# EAGLE schematic 24x16_RGB_ATXMega_Wifi_BBuck (EAGLE 6.5.0)

## Sheet 1 of 8
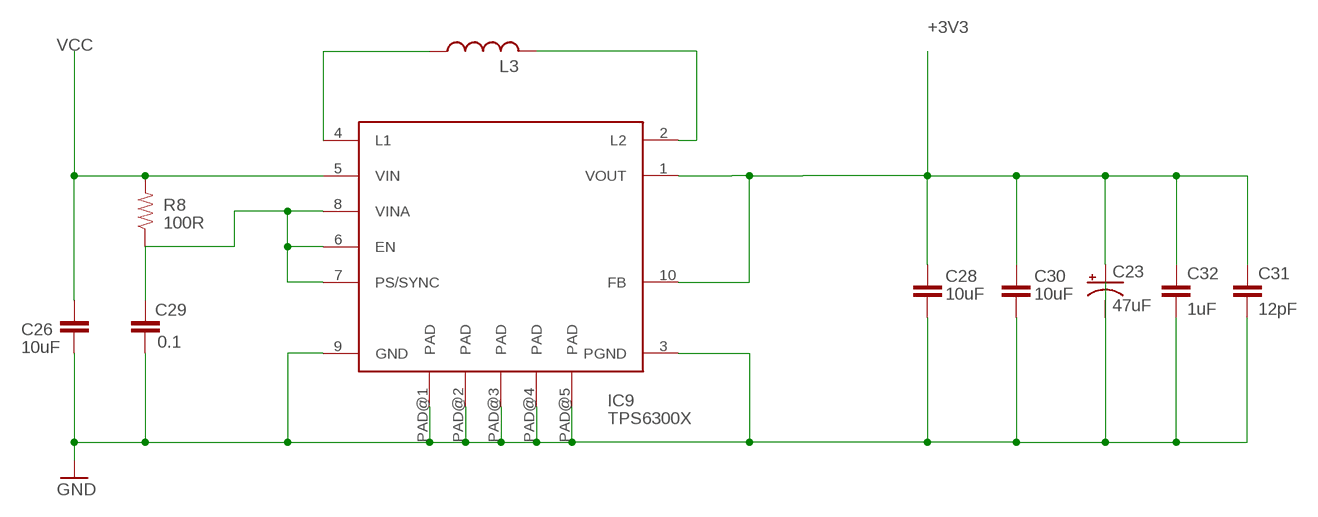
[diagram p0: schematic, sheet 1]

### Parts
C23  47uF  CAP_POL3528  [EIA3528]
C26  10uF  CAP0805  [0805]
C28  10uF  CAP0805  [0805]
C29  0.1  CAP0805  [0805]
C30  10uF  CAP0805  [0805]
C31  12pF  CAP0805  [0805]
C32  1uF  CAP0805  [0805]
IC9  TPS6300X  [QFN_10_PAD]
L3  L-USL1812  [L1812]
R8  100R  RESISTOR0805  [0805]

### Nets
+3V3: C23.A(+) C28.1 C30.1 C31.1 C32.1 IC9.1(VOUT) IC9.10(FB) ; also sheet 2,7,8
GND: C23.C(-) C26.2 C28.2 C29.1 C30.2 C31.2 C32.2 IC9.3(PGND) IC9.9(GND) IC9.PAD@1(PAD) IC9.PAD@2(PAD) IC9.PAD@3(PAD) IC9.PAD@4(PAD) IC9.PAD@5(PAD) ; also sheet 2,3,5,6,7,8
N$24: IC9.2(L2) L3.2
N$30: IC9.4(L1) L3.1
N$32: C29.2 IC9.6(EN) IC9.7(PS/SYNC) IC9.8(VINA) R8.1
VCC: C26.1 IC9.5(VIN) R8.2 ; also sheet 2,3,4,5,6

## Sheet 2 of 8
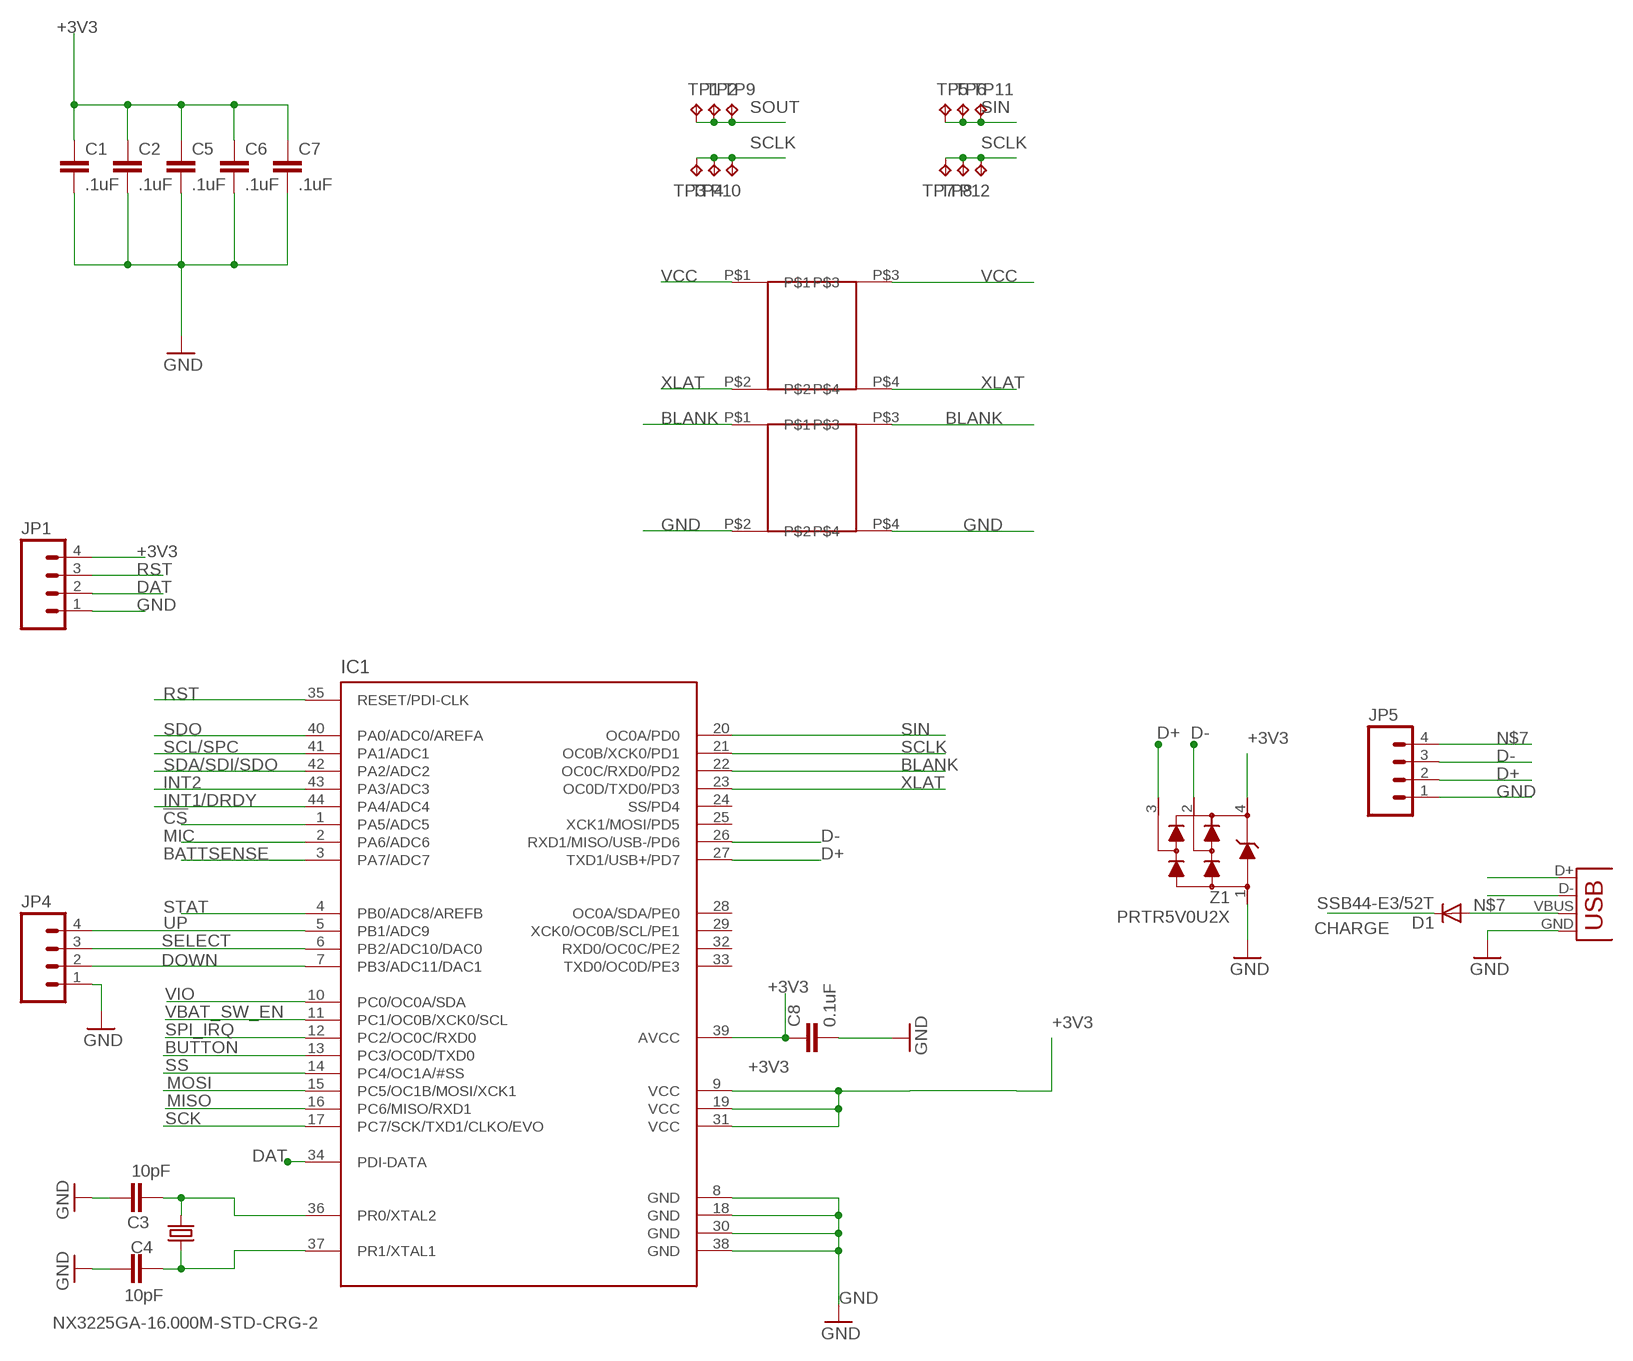
[diagram p1: schematic, sheet 2]

### Parts
C1  .1uF  CAP0805  [0805]
C2  .1uF  CAP0805  [0805]
C3  10pF  CAP0805  [0805]
C4  10pF  CAP0805  [0805]
C5  .1uF  CAP0805  [0805]
C6  .1uF  CAP0805  [0805]
C7  .1uF  CAP0805  [0805]
C8  0.1uF  CAP0805  [0805]
D1  SSB44-E3/52T  DIODE-DO214AA  [DO214AA]
IC1  NONOLITH_ATXMEGAXXA4U-AU  [NONOLITH_TQFP-44]
JP1  M04PTH  [1X04]
JP3  USBSMD  [USB-MINIB]
JP4  M04PTH  [1X04]
JP5  M04PTH  [1X04]
SLOT1  SLOT  [SLOT]
SLOT2  SLOT  [SLOT]
TP1  TPTP20SQ  [TP20SQ]
TP2  TPTP20SQ  [TP20SQ]
TP3  TPTP20SQ  [TP20SQ]
TP4  TPTP20SQ  [TP20SQ]
TP5  TPTP20SQ  [TP20SQ]
TP6  TPTP20SQ  [TP20SQ]
TP7  TPTP20SQ  [TP20SQ]
TP8  TPTP20SQ  [TP20SQ]
TP9  TPTP20SQ  [TP20SQ]
TP10  TPTP20SQ  [TP20SQ]
TP11  TPTP20SQ  [TP20SQ]
TP12  TPTP20SQ  [TP20SQ]
X1  NX3225GA-16.000M-STD-CRG-2  NX3225GA  [NX3225GA]
Z1  PRTR5V0U2X  [SOT143B]

### Nets
!CS: IC1.1(PA5/ADC5) ; also sheet 7
+3V3: C1.1 C2.1 C5.1 C6.1 C7.1 C8.1 IC1.9(VCC) IC1.19(VCC) IC1.31(VCC) IC1.39(AVCC) JP1.4 Z1.4 ; also sheet 1,7,8
BATTSENSE: IC1.3(PA7/ADC7) ; also sheet 5
BLANK: IC1.22(OC0C/RXD0/PD2) SLOT2.P$1 SLOT2.P$3 ; also sheet 3
BUTTON: IC1.13(PC3/OC0D/TXD0) ; also sheet 7
CHARGE: D1.C ; also sheet 5
D+: IC1.27(TXD1/USB+/PD7) JP3.D+ JP5.2 Z1.3
D-: IC1.26(RXD1/MISO/USB-/PD6) JP3.D- JP5.3 Z1.2
DAT: IC1.34(PDI-DATA) JP1.2
DOWN: IC1.7(PB3/ADC11/DAC1) JP4.2
GND: C1.2 C2.2 C3.1 C4.1 C5.2 C6.2 C7.2 C8.2 IC1.8(GND) IC1.18(GND) IC1.30(GND) IC1.38(GND) JP1.1 JP3.GND JP4.1 JP5.1 SLOT2.P$2 SLOT2.P$4 Z1.1 ; also sheet 1,3,5,6,7,8
INT1/DRDY: IC1.44(PA4/ADC4) ; also sheet 7
INT2: IC1.43(PA3/ADC3) ; also sheet 7
MIC: IC1.2(PA6/ADC6) ; also sheet 8
MISO: IC1.16(PC6/MISO/RXD1) ; also sheet 6
MOSI: IC1.15(PC5/OC1B/MOSI/XCK1) ; also sheet 6
N$7: D1.A JP3.VBUS JP5.4
N$36: C3.2 IC1.36(PR0/XTAL2) X1.3
N$37: C4.2 IC1.37(PR1/XTAL1) X1.1
RST: IC1.35(RESET/PDI-CLK) JP1.3 ; also sheet 7
SCK: IC1.17(PC7/SCK/TXD1/CLKO/EVO) ; also sheet 6
SCL/SPC: IC1.41(PA1/ADC1) ; also sheet 7
SCLK: IC1.21(OC0B/XCK0/PD1) TP3.TP TP4.TP TP7.TP TP8.TP TP10.TP TP12.TP ; also sheet 3
SDA/SDI/SDO: IC1.42(PA2/ADC2) ; also sheet 7
SDO: IC1.40(PA0/ADC0/AREFA) ; also sheet 7
SELECT: IC1.6(PB2/ADC10/DAC0) JP4.3
SIN: IC1.20(OC0A/PD0) TP5.TP TP6.TP TP11.TP ; also sheet 3
SOUT: TP1.TP TP2.TP TP9.TP ; also sheet 3
SPI_IRQ: IC1.12(PC2/OC0C/RXD0) ; also sheet 6
SS: IC1.14(PC4/OC1A/#SS) ; also sheet 6
STAT: IC1.4(PB0/ADC8/AREFB) ; also sheet 5
UP: IC1.5(PB1/ADC9) JP4.4
VBAT_SW_EN: IC1.11(PC1/OC0B/XCK0/SCL) ; also sheet 6
VCC: SLOT1.P$1 SLOT1.P$3 ; also sheet 1,3,4,5,6
VIO: IC1.10(PC0/OC0A/SDA) ; also sheet 6
XLAT: IC1.23(OC0D/TXD0/PD3) SLOT1.P$2 SLOT1.P$4 ; also sheet 3
Unconnected: IC1.24(SS/PD4) IC1.25(XCK1/MOSI/PD5) IC1.28(OC0A/SDA/PE0) IC1.29(XCK0/OC0B/SCL/PE1) IC1.32(RXD0/OC0C/PE2) IC1.33(TXD0/OC0D/PE3)

## Sheet 3 of 8
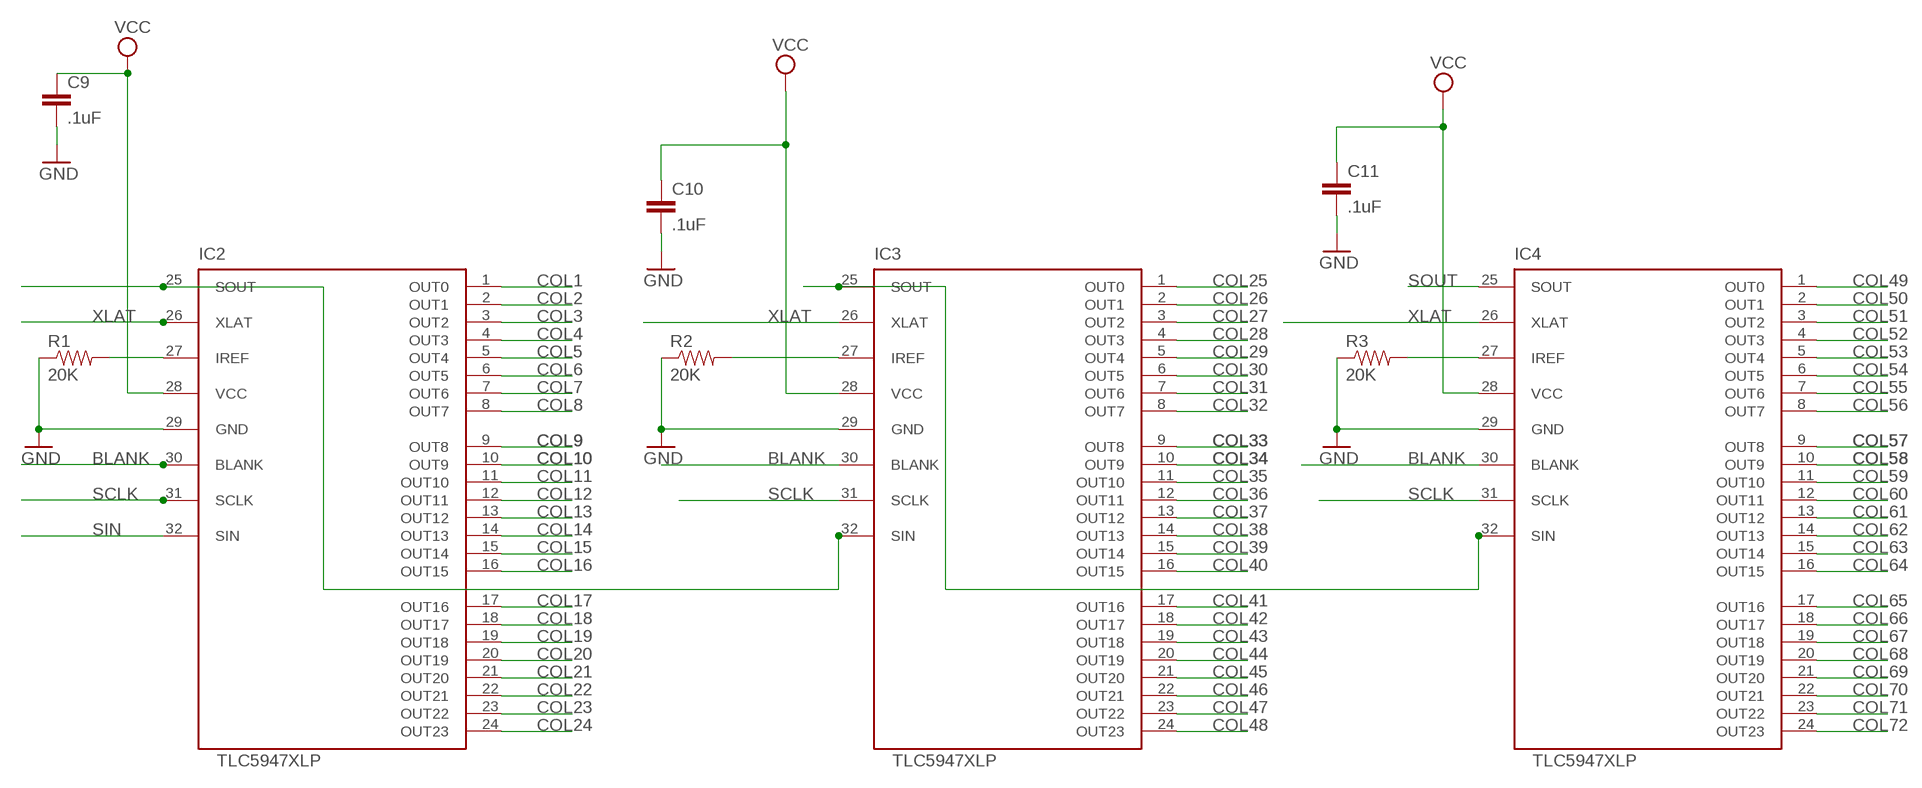
[diagram p2: schematic, sheet 3]

### Parts
C9  .1uF  CAP0805  [0805]
C10  .1uF  CAP0805  [0805]
C11  .1uF  CAP0805  [0805]
IC2  TLC5947XLP  [QFN32_XLP]
IC3  TLC5947XLP  [QFN32_XLP]
IC4  TLC5947XLP  [QFN32_XLP]
R1  20K  RESISTOR  [0805]
R2  20K  RESISTOR  [0805]
R3  20K  RESISTOR  [0805]

### Nets
BLANK: IC2.30(BLANK) IC3.30(BLANK) IC4.30(BLANK) ; also sheet 2
COL1: IC2.1(OUT0) ; also sheet 4
COL2: IC2.2(OUT1) ; also sheet 4
COL3: IC2.3(OUT2) ; also sheet 4
COL4: IC2.4(OUT3) ; also sheet 4
COL5: IC2.5(OUT4) ; also sheet 4
COL6: IC2.6(OUT5) ; also sheet 4
COL7: IC2.7(OUT6) ; also sheet 4
COL8: IC2.8(OUT7) ; also sheet 4
COL9: IC2.9(OUT8) ; also sheet 4
COL10: IC2.10(OUT9) ; also sheet 4
COL11: IC2.11(OUT10) ; also sheet 4
COL12: IC2.12(OUT11) ; also sheet 4
COL13: IC2.13(OUT12) ; also sheet 4
COL14: IC2.14(OUT13) ; also sheet 4
COL15: IC2.15(OUT14) ; also sheet 4
COL16: IC2.16(OUT15) ; also sheet 4
COL17: IC2.17(OUT16) ; also sheet 4
COL18: IC2.18(OUT17) ; also sheet 4
COL19: IC2.19(OUT18) ; also sheet 4
COL20: IC2.20(OUT19) ; also sheet 4
COL21: IC2.21(OUT20) ; also sheet 4
COL22: IC2.22(OUT21) ; also sheet 4
COL23: IC2.23(OUT22) ; also sheet 4
COL24: IC2.24(OUT23) ; also sheet 4
COL25: IC3.1(OUT0) ; also sheet 4
COL26: IC3.2(OUT1) ; also sheet 4
COL27: IC3.3(OUT2) ; also sheet 4
COL28: IC3.4(OUT3) ; also sheet 4
COL29: IC3.5(OUT4) ; also sheet 4
COL30: IC3.6(OUT5) ; also sheet 4
COL31: IC3.7(OUT6) ; also sheet 4
COL32: IC3.8(OUT7) ; also sheet 4
COL33: IC3.9(OUT8) ; also sheet 4
COL34: IC3.10(OUT9) ; also sheet 4
COL35: IC3.11(OUT10) ; also sheet 4
COL36: IC3.12(OUT11) ; also sheet 4
COL37: IC3.13(OUT12) ; also sheet 4
COL38: IC3.14(OUT13) ; also sheet 4
COL39: IC3.15(OUT14) ; also sheet 4
COL40: IC3.16(OUT15) ; also sheet 4
COL41: IC3.17(OUT16) ; also sheet 4
COL42: IC3.18(OUT17) ; also sheet 4
COL43: IC3.19(OUT18) ; also sheet 4
COL44: IC3.20(OUT19) ; also sheet 4
COL45: IC3.21(OUT20) ; also sheet 4
COL46: IC3.22(OUT21) ; also sheet 4
COL47: IC3.23(OUT22) ; also sheet 4
COL48: IC3.24(OUT23) ; also sheet 4
COL49: IC4.1(OUT0) ; also sheet 4
COL50: IC4.2(OUT1) ; also sheet 4
COL51: IC4.3(OUT2) ; also sheet 4
COL52: IC4.4(OUT3) ; also sheet 4
COL53: IC4.5(OUT4) ; also sheet 4
COL54: IC4.6(OUT5) ; also sheet 4
COL55: IC4.7(OUT6) ; also sheet 4
COL56: IC4.8(OUT7) ; also sheet 4
COL57: IC4.9(OUT8) ; also sheet 4
COL58: IC4.10(OUT9) ; also sheet 4
COL59: IC4.11(OUT10) ; also sheet 4
COL60: IC4.12(OUT11) ; also sheet 4
COL61: IC4.13(OUT12) ; also sheet 4
COL62: IC4.14(OUT13) ; also sheet 4
COL63: IC4.15(OUT14) ; also sheet 4
COL64: IC4.16(OUT15) ; also sheet 4
COL65: IC4.17(OUT16) ; also sheet 4
COL66: IC4.18(OUT17) ; also sheet 4
COL67: IC4.19(OUT18) ; also sheet 4
COL68: IC4.20(OUT19) ; also sheet 4
COL69: IC4.21(OUT20) ; also sheet 4
COL70: IC4.22(OUT21) ; also sheet 4
COL71: IC4.23(OUT22) ; also sheet 4
COL72: IC4.24(OUT23) ; also sheet 4
GND: C9.2 C10.2 C11.2 IC2.29(GND) IC3.29(GND) IC4.29(GND) R1.1 R2.1 R3.1 ; also sheet 1,2,5,6,7,8
HOLE: IC2.27(IREF) R1.2
N$2: IC3.27(IREF) R2.2
N$3: IC2.25(SOUT) IC3.32(SIN)
N$9: IC4.27(IREF) R3.2
N$19: IC3.25(SOUT) IC4.32(SIN)
SCLK: IC2.31(SCLK) IC3.31(SCLK) IC4.31(SCLK) ; also sheet 2
SIN: IC2.32(SIN) ; also sheet 2
SOUT: IC4.25(SOUT) ; also sheet 2
VCC: C9.1 C10.1 C11.1 IC2.28(VCC) IC3.28(VCC) IC4.28(VCC) ; also sheet 1,2,4,5,6
XLAT: IC2.26(XLAT) IC3.26(XLAT) IC4.26(XLAT) ; also sheet 2

## Sheet 4 of 8
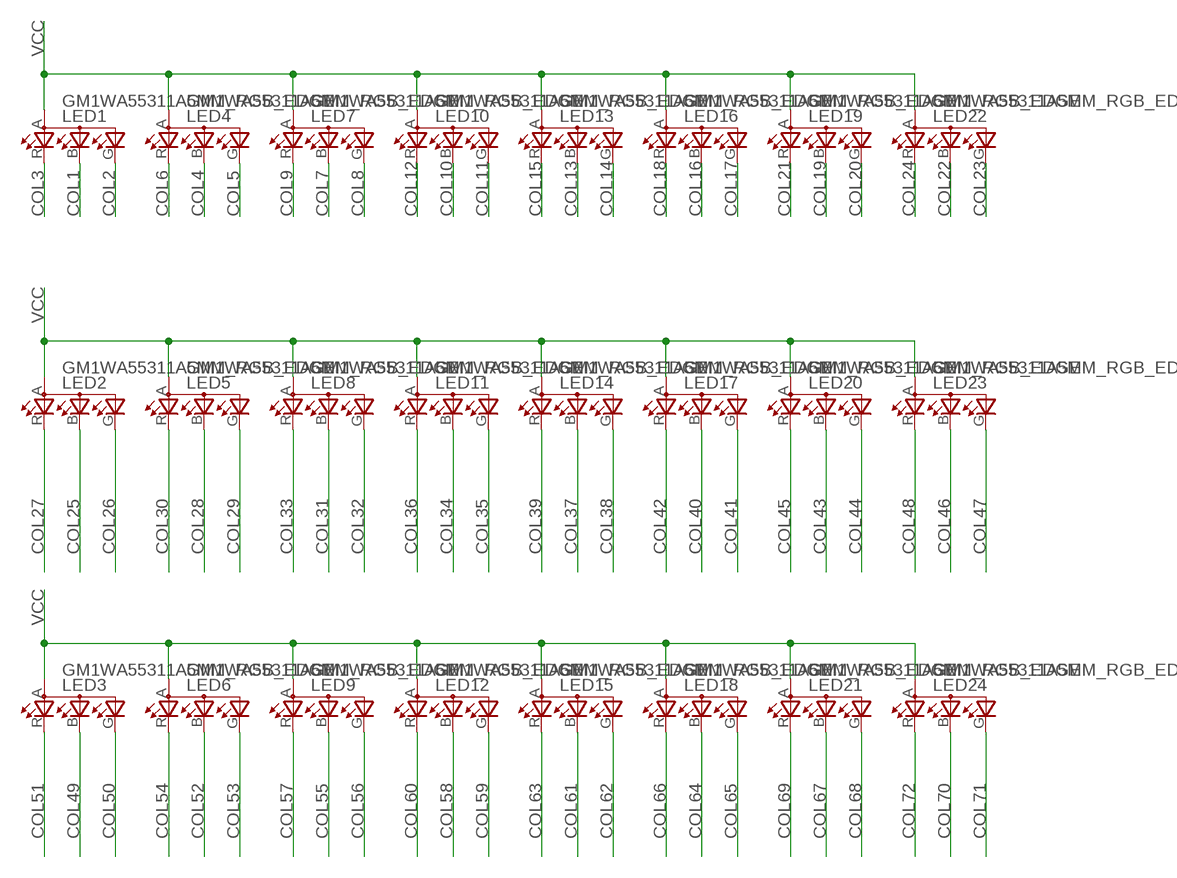
[diagram p3: schematic, sheet 4]

### Parts
LED1  GM1WA55311A5MM_RGB_EDGE  [LED5MM_RGB_EDGE]
LED2  GM1WA55311A5MM_RGB_EDGE  [LED5MM_RGB_EDGE]
LED3  GM1WA55311A5MM_RGB_EDGE  [LED5MM_RGB_EDGE]
LED4  GM1WA55311A5MM_RGB_EDGE  [LED5MM_RGB_EDGE]
LED5  GM1WA55311A5MM_RGB_EDGE  [LED5MM_RGB_EDGE]
LED6  GM1WA55311A5MM_RGB_EDGE  [LED5MM_RGB_EDGE]
LED7  GM1WA55311A5MM_RGB_EDGE  [LED5MM_RGB_EDGE]
LED8  GM1WA55311A5MM_RGB_EDGE  [LED5MM_RGB_EDGE]
LED9  GM1WA55311A5MM_RGB_EDGE  [LED5MM_RGB_EDGE]
LED10  GM1WA55311A5MM_RGB_EDGE  [LED5MM_RGB_EDGE]
LED11  GM1WA55311A5MM_RGB_EDGE  [LED5MM_RGB_EDGE]
LED12  GM1WA55311A5MM_RGB_EDGE  [LED5MM_RGB_EDGE]
LED13  GM1WA55311A5MM_RGB_EDGE  [LED5MM_RGB_EDGE]
LED14  GM1WA55311A5MM_RGB_EDGE  [LED5MM_RGB_EDGE]
LED15  GM1WA55311A5MM_RGB_EDGE  [LED5MM_RGB_EDGE]
LED16  GM1WA55311A5MM_RGB_EDGE  [LED5MM_RGB_EDGE]
LED17  GM1WA55311A5MM_RGB_EDGE  [LED5MM_RGB_EDGE]
LED18  GM1WA55311A5MM_RGB_EDGE  [LED5MM_RGB_EDGE]
LED19  GM1WA55311A5MM_RGB_EDGE  [LED5MM_RGB_EDGE]
LED20  GM1WA55311A5MM_RGB_EDGE  [LED5MM_RGB_EDGE]
LED21  GM1WA55311A5MM_RGB_EDGE  [LED5MM_RGB_EDGE]
LED22  GM1WA55311A5MM_RGB_EDGE  [LED5MM_RGB_EDGE]
LED23  GM1WA55311A5MM_RGB_EDGE  [LED5MM_RGB_EDGE]
LED24  GM1WA55311A5MM_RGB_EDGE  [LED5MM_RGB_EDGE]

### Nets
COL1: LED1.B(CBLUE) ; also sheet 3
COL2: LED1.G(CGREEN) ; also sheet 3
COL3: LED1.R(CRED) ; also sheet 3
COL4: LED4.B(CBLUE) ; also sheet 3
COL5: LED4.G(CGREEN) ; also sheet 3
COL6: LED4.R(CRED) ; also sheet 3
COL7: LED7.B(CBLUE) ; also sheet 3
COL8: LED7.G(CGREEN) ; also sheet 3
COL9: LED7.R(CRED) ; also sheet 3
COL10: LED10.B(CBLUE) ; also sheet 3
COL11: LED10.G(CGREEN) ; also sheet 3
COL12: LED10.R(CRED) ; also sheet 3
COL13: LED13.B(CBLUE) ; also sheet 3
COL14: LED13.G(CGREEN) ; also sheet 3
COL15: LED13.R(CRED) ; also sheet 3
COL16: LED16.B(CBLUE) ; also sheet 3
COL17: LED16.G(CGREEN) ; also sheet 3
COL18: LED16.R(CRED) ; also sheet 3
COL19: LED19.B(CBLUE) ; also sheet 3
COL20: LED19.G(CGREEN) ; also sheet 3
COL21: LED19.R(CRED) ; also sheet 3
COL22: LED22.B(CBLUE) ; also sheet 3
COL23: LED22.G(CGREEN) ; also sheet 3
COL24: LED22.R(CRED) ; also sheet 3
COL25: LED2.B(CBLUE) ; also sheet 3
COL26: LED2.G(CGREEN) ; also sheet 3
COL27: LED2.R(CRED) ; also sheet 3
COL28: LED5.B(CBLUE) ; also sheet 3
COL29: LED5.G(CGREEN) ; also sheet 3
COL30: LED5.R(CRED) ; also sheet 3
COL31: LED8.B(CBLUE) ; also sheet 3
COL32: LED8.G(CGREEN) ; also sheet 3
COL33: LED8.R(CRED) ; also sheet 3
COL34: LED11.B(CBLUE) ; also sheet 3
COL35: LED11.G(CGREEN) ; also sheet 3
COL36: LED11.R(CRED) ; also sheet 3
COL37: LED14.B(CBLUE) ; also sheet 3
COL38: LED14.G(CGREEN) ; also sheet 3
COL39: LED14.R(CRED) ; also sheet 3
COL40: LED17.B(CBLUE) ; also sheet 3
COL41: LED17.G(CGREEN) ; also sheet 3
COL42: LED17.R(CRED) ; also sheet 3
COL43: LED20.B(CBLUE) ; also sheet 3
COL44: LED20.G(CGREEN) ; also sheet 3
COL45: LED20.R(CRED) ; also sheet 3
COL46: LED23.B(CBLUE) ; also sheet 3
COL47: LED23.G(CGREEN) ; also sheet 3
COL48: LED23.R(CRED) ; also sheet 3
COL49: LED3.B(CBLUE) ; also sheet 3
COL50: LED3.G(CGREEN) ; also sheet 3
COL51: LED3.R(CRED) ; also sheet 3
COL52: LED6.B(CBLUE) ; also sheet 3
COL53: LED6.G(CGREEN) ; also sheet 3
COL54: LED6.R(CRED) ; also sheet 3
COL55: LED9.B(CBLUE) ; also sheet 3
COL56: LED9.G(CGREEN) ; also sheet 3
COL57: LED9.R(CRED) ; also sheet 3
COL58: LED12.B(CBLUE) ; also sheet 3
COL59: LED12.G(CGREEN) ; also sheet 3
COL60: LED12.R(CRED) ; also sheet 3
COL61: LED15.B(CBLUE) ; also sheet 3
COL62: LED15.G(CGREEN) ; also sheet 3
COL63: LED15.R(CRED) ; also sheet 3
COL64: LED18.B(CBLUE) ; also sheet 3
COL65: LED18.G(CGREEN) ; also sheet 3
COL66: LED18.R(CRED) ; also sheet 3
COL67: LED21.B(CBLUE) ; also sheet 3
COL68: LED21.G(CGREEN) ; also sheet 3
COL69: LED21.R(CRED) ; also sheet 3
COL70: LED24.B(CBLUE) ; also sheet 3
COL71: LED24.G(CGREEN) ; also sheet 3
COL72: LED24.R(CRED) ; also sheet 3
VCC: LED1.A LED2.A LED3.A LED4.A LED5.A LED6.A LED7.A LED8.A LED9.A LED10.A LED11.A LED12.A LED13.A LED14.A LED15.A LED16.A LED17.A LED18.A LED19.A LED20.A LED21.A LED22.A LED23.A LED24.A ; also sheet 1,2,3,5,6

## Sheet 5 of 8
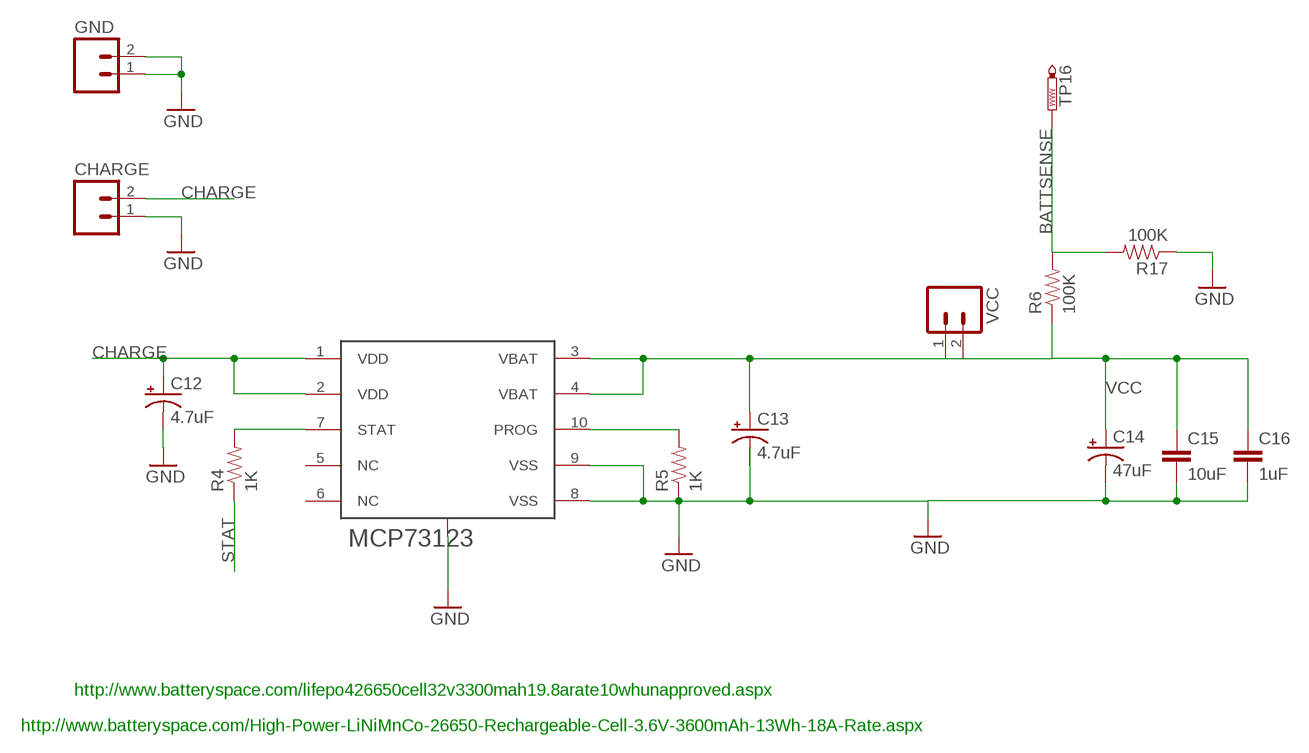
[diagram p4: schematic, sheet 5]

### Parts
C12  4.7uF  CAP_POL3528  [EIA3528]
C13  4.7uF  CAP_POL3528  [EIA3528]
C14  47uF  CAP_POL3528  [EIA3528]
C15  10uF  CAP0805  [0805]
C16  1uF  CAP0805  [0805]
CHARGE  M02PTH  [1X02]
GND  M02PTH  [1X02]
IC5  MCP73123  [DFN10_3X3]
R4  1K  RESISTOR0805  [0805]
R5  1K  RESISTOR0805  [0805]
R6  100K  RESISTOR0805  [0805]
R17  100K  RESISTOR0805  [0805]
TP16  BATT  PTR1TP12SQ  [TP12SQ]
VCC  M02PTH  [1X02]

### Nets
BATTSENSE: R6.2 R17.2 TP16.TP ; also sheet 2
CHARGE: C12.A(+) CHARGE.2 IC5.1(VDD) IC5.2(VDD) ; also sheet 2
GND: C12.C(-) C13.C(-) C14.C(-) C15.2 C16.2 CHARGE.1 GND.1 GND.2 IC5.8(VSS) IC5.9(VSS) IC5.EXP(GND) R5.1 R17.1 ; also sheet 1,2,3,6,7,8
N$1: IC5.7(STAT) R4.2
N$6: IC5.10(PROG) R5.2
STAT: R4.1 ; also sheet 2
VCC: C13.A(+) C14.A(+) C15.1 C16.1 IC5.3(VBAT) IC5.4(VBAT) R6.1 VCC.1 VCC.2 ; also sheet 1,2,3,4,6
Unconnected: IC5.5(NC) IC5.6(NC)

### Notes on the sheet
- http://www.batteryspace.com/lifepo426650cell32v3300mah19.8arate10whunapproved.aspx
- http://www.batteryspace.com/High-Power-LiNiMnCo-26650-Rechargeable-Cell-3.6V-3600mAh-13Wh-18A-Rate.aspx

## Sheet 6 of 8
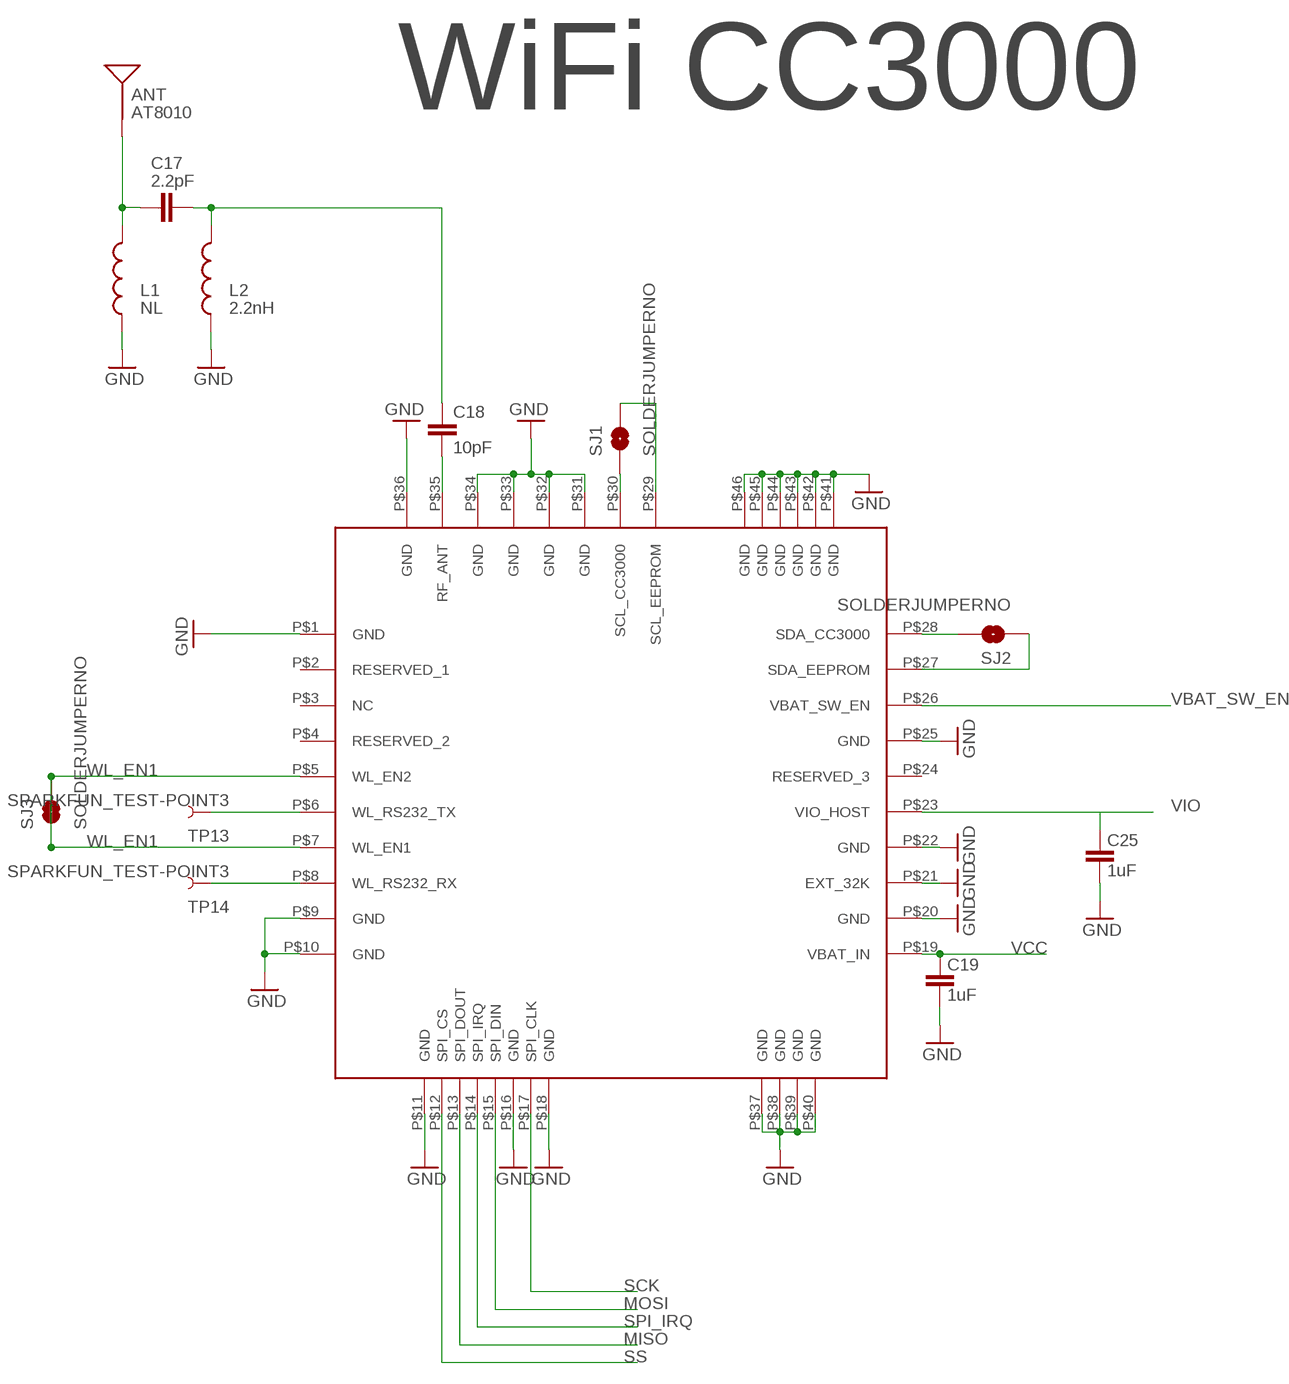
[diagram p5: schematic, sheet 6]

### Parts
ANT  AT8010  ANTENNA2  [AT8010]
C17  2.2pF  CAP0402-CAP  [0402-CAP]
C18  10pF  CAP0402-CAP  [0402-CAP]
C19  1uF  CAP0805  [0805]
C25  1uF  CAP0805  [0805]
IC6  CC3000  [CC3000]
L1  NL  INDUCTOR0402  [C0402]
L2  2.2nH  INDUCTOR0402  [C0402]
SJ1  SOLDERJUMPERNO  [SJ_2S-NO]
SJ2  SOLDERJUMPERNO  [SJ_2S-NO]
SJ3  SOLDERJUMPERNO  [SJ_2S-NO]
TP13  SPARKFUN_TEST-POINT3  [SPARKFUN_PAD.03X.03]
TP14  SPARKFUN_TEST-POINT3  [SPARKFUN_PAD.03X.03]

### Nets
GND: C19.1 C25.1 IC6.P$1(GND) IC6.P$9(GND) IC6.P$10(GND) IC6.P$11(GND) IC6.P$16(GND) IC6.P$18(GND) IC6.P$20(GND) IC6.P$21(EXT_32K) IC6.P$22(GND) IC6.P$25(GND) IC6.P$31(GND) IC6.P$32(GND) IC6.P$33(GND) IC6.P$34(GND) IC6.P$36(GND) IC6.P$37(GND) IC6.P$38(GND) IC6.P$39(GND) IC6.P$40(GND) IC6.P$41(GND) IC6.P$42(GND) IC6.P$43(GND) IC6.P$44(GND) IC6.P$45(GND) IC6.P$46(GND) L1.1 L2.1 ; also sheet 1,2,3,5,7,8
MISO: IC6.P$13(SPI_DOUT) ; also sheet 2
MOSI: IC6.P$15(SPI_DIN) ; also sheet 2
N$8: C18.2 IC6.P$35(RF_ANT)
N$21: IC6.P$6(WL_RS232_TX) TP13.P$1
N$22: C17.2 C18.1 L2.2
N$23: IC6.P$8(WL_RS232_RX) TP14.P$1
N$25: ANT.P$1(SIGNAL) C17.1 L1.2
N$26: IC6.P$30(SCL_CC3000) SJ1.1
N$27: IC6.P$29(SCL_EEPROM) SJ1.2
N$28: IC6.P$28(SDA_CC3000) SJ2.2
N$29: IC6.P$27(SDA_EEPROM) SJ2.1
SCK: IC6.P$17(SPI_CLK) ; also sheet 2
SPI_IRQ: IC6.P$14(SPI_IRQ) ; also sheet 2
SS: IC6.P$12(SPI_CS) ; also sheet 2
VBAT_SW_EN: IC6.P$26(VBAT_SW_EN) ; also sheet 2
VCC: C19.2 IC6.P$19(VBAT_IN) ; also sheet 1,2,3,4,5
VIO: C25.2 IC6.P$23(VIO_HOST) ; also sheet 2
WL_EN1: IC6.P$5(WL_EN2) IC6.P$7(WL_EN1) SJ3.1 SJ3.2
Unconnected: IC6.P$2(RESERVED_1) IC6.P$3(NC) IC6.P$4(RESERVED_2) IC6.P$24(RESERVED_3)

### Notes on the sheet
- WiFi CC3000

## Sheet 7 of 8
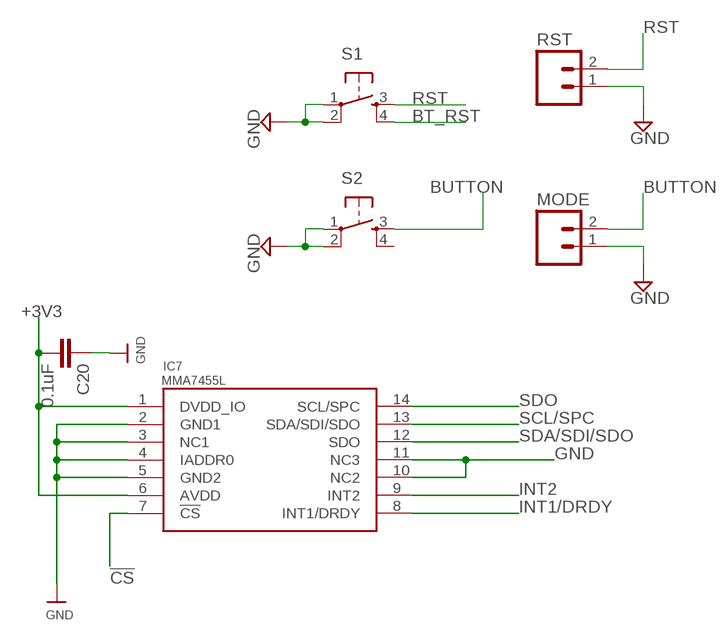
[diagram p6: schematic, sheet 7]

### Parts
C20  0.1uF  CAP0805  [0805]
IC7  MMA7455L  [LGA-14]
MODE  M02PTH  [1X02]
RST  M02PTH  [1X02]
S1  TAC_SWITCHSMD  [TACTILE_SWITCH_SMD]
S2  TAC_SWITCHSMD  [TACTILE_SWITCH_SMD]

### Nets
!CS: IC7.7(!CS) ; also sheet 2
+3V3: C20.2 IC7.1(DVDD_IO) IC7.6(AVDD) ; also sheet 1,2,8
BT_RST: S1.4
BUTTON: MODE.2 S2.3 ; also sheet 2
GND: C20.1 IC7.2(GND1) IC7.3(NC1) IC7.4(IADDR0) IC7.5(GND2) IC7.10(NC2) IC7.11(NC3) MODE.1 RST.1 S1.1 S1.2 S2.1 S2.2 ; also sheet 1,2,3,5,6,8
INT1/DRDY: IC7.8(INT1/DRDY) ; also sheet 2
INT2: IC7.9(INT2) ; also sheet 2
RST: RST.2 S1.3 ; also sheet 2
SCL/SPC: IC7.13(SDA/SDI/SDO) ; also sheet 2
SDA/SDI/SDO: IC7.12(SDO) ; also sheet 2
SDO: IC7.14(SCL/SPC) ; also sheet 2
Unconnected: S2.4

## Sheet 8 of 8
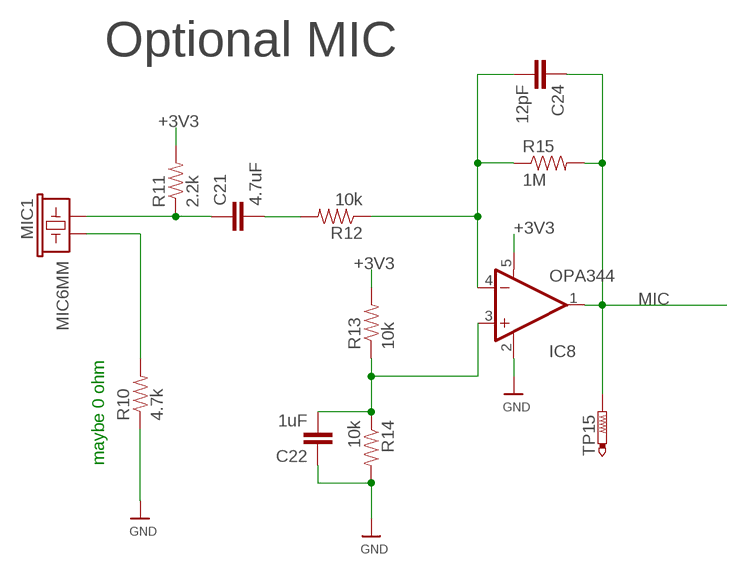
[diagram p7: schematic, sheet 8]

### Parts
C21  4.7uF  CAP0805  [0805]
C22  1uF  CAP0805  [0805]
C24  12pF  CAP0805  [0805]
IC8  OPA344  [SOT23-5]
MIC1  MIC6MM  [MIC-6MM]
R10  4.7k  RESISTOR  [0805]
R11  2.2k  RESISTOR  [0805]
R12  10k  RESISTOR  [0805]
R13  10k  RESISTOR  [0805]
R14  10k  RESISTOR  [0805]
R15  1M  RESISTOR  [0805]
TP15  MIC  PTR1TP12SQ  [TP12SQ]

### Nets
+3V3: IC8.5(V+) R11.2 R13.2 ; also sheet 1,2,7
GND: C22.1 IC8.2(V-) R10.1 R14.2 ; also sheet 1,2,3,5,6,7
MIC: C24.1 IC8.1(OUT) R15.2 TP15.TP ; also sheet 2
N$14: C21.2 R12.2
N$15: C21.1 MIC1.1 R11.1
N$16: C22.2 IC8.3(+IN) R13.1 R14.1
N$17: C24.2 IC8.4(-IN) R12.1 R15.1
N$20: MIC1.2 R10.2

### Notes on the sheet
- Optional MIC
- maybe 0 ohm

## Power pins joined to a net without a drawn wire
DGND: X1.2(DGND) X1.4(DGND)

## Library data of the parts
ANT = 24x16_RGB_ATXMega_Wifi:ANTENNA2: Antenna Single endded antenna. Common with smaller chip antennas. CHIP4 package is the GPS Chip Antenna SKU: GPS-08418. CHIP5 package is 2.4GHz chip antenna SKU: WRL-00144.
C1 C2 C5-C7 C9-C11 = slice_noshift:CAP: Capacitor Standard 0603 ceramic capacitor, and 0.1" leaded capacitor.; MPN: 08055C105MAT2A; OC_NEWARK: 73T5385
C3 C4 C8 C17-C19 C25 = SparkFun:CAP: Capacitor Standard 0603 ceramic capacitor, and 0.1" leaded capacitor.
C12 C13 = slice_noshift:CAP_POL: Capacitor Polarized These are standard SMD and PTH capacitors. Normally 10uF, 47uF, and 100uF in electrolytic and tantalum varieties. Always verify the external diameter of the through hole cap, it varies with capacity, voltage, and manufacturer. The EIA devices should be standard.; MPN: 0805YD475KAT2A; OC_NEWARK: 96M1306
C14 C23 = slice_noshift:CAP_POL: Capacitor Polarized These are standard SMD and PTH capacitors. Normally 10uF, 47uF, and 100uF in electrolytic and tantalum varieties. Always verify the external diameter of the through hole cap, it varies with capacity, voltage, and manufacturer. The EIA devices should be standard.; OC_NEWARK: unknown
C15 C16 C32 = 24x16_RGB:CAP: Capacitor Standard 0603 ceramic capacitor, and 0.1" leaded capacitor.; MPN: 08055D105KAT2A; OC_NEWARK: 66M3779
C20 = SparkFun:CAP: Capacitor Standard 0603 ceramic capacitor, and 0.1" leaded capacitor.; MPN: 08055C104K4T2A; OC_NEWARK: 95W2729
C21 = SparkFun:CAP: Capacitor Standard 0603 ceramic capacitor, and 0.1" leaded capacitor.; MPN: 08053D475KAT2A; OC_NEWARK: 15P4053
C22 = SparkFun:CAP: Capacitor Standard 0603 ceramic capacitor, and 0.1" leaded capacitor.; MPN: 08055D105KAT2A; OC_NEWARK: 66M3779
C24 C31 = SparkFun:CAP: Capacitor Standard 0603 ceramic capacitor, and 0.1" leaded capacitor.; MF: AVX CORPORATION; MPN: 08055A120JAT2A; OC_NEWARK: 30H0781
C26 C28-C30 = CH_passive:CAP: Capacitor Standard 0603 ceramic capacitor, and 0.1" leaded capacitor.
CHARGE GND VCC = SparkFun:M02: Header 2 Standard 2-pin 0.1" header. Use with straight break away headers (SKU : PRT-00116), right angle break away headers (PRT-00553), swiss pins (PRT-00743), machine pins (PRT-00117), and female headers (PRT-00115). Molex polarized connector foot print use with SKU : PRT-08233 with associated crimp pins and housings.; OC_NEWARK: unknown
D1 = diode:DIODE-: DIODE
IC1 = Outline:NONOLITH_ATXMEGAXXA4U: ATXMEGA A4U Series (XMEGA+USB)
IC2-IC4 = slice_noshift:TLC5947; OC_NEWARK: unknown
IC5 = 24x16_RGB:MCP73123; MPN: MCP73123T-22SI/MF; OC_NEWARK: 14R8877
IC6 = centerblack_engineering:CC3000: TI SimpleLink CC3000 Module - WiFi 802.11b/g Network Processor; AUTHOR: Matt Bigarani; DATASHEET: http://www.ti.com/lit/ds/symlink/cc3000.pdf; DATE: 2/8/2013
IC7 = MMA7455Lbreakoutboard-v1a:MMA7455L; MPN: MMA7455LR2; OC_NEWARK: 69M3900
IC8 = SparkFun:OPA344; MPN: OPA344NA/250G4; OC_NEWARK: 13M5179
IC9 = 24x16_RGB_ATXMega_Wifi_BBuck:TPS6300X
JP1 JP4 JP5 = SparkFun-Connectors:M04: Header 4 Standard 4-pin 0.1" header. Use with straight break away headers (SKU : PRT-00116), right angle break away headers (PRT-00553), swiss pins (PRT-00743), machine pins (PRT-00117), and female headers (PRT-00115). Molex polarized connector foot print use with SKU : PRT-08231 with associated crimp pins and housings. 1MM SMD Version SKU: PRT-10208
JP3 = SparkFun-Connectors:USB: USB Connectors USB-B-PTH is fully proven SKU : PRT-00139/CONN-08278 USB-miniB is fully proven SKU : PRT-00587 USB-A-PCB is untested. USB-A-H is throughly reviewed, but untested. Spark Fun Electronics SKU : PRT-00437 USB-B-SMT is throughly reviewed, but untested. Needs silkscreen touching up. USB-A-S has not been used/tested USB-MB-H has not been used/tested USB-MICROB has been used. CONN-09505
L1 L2 = SparkFun:INDUCTOR: Inductors Basic Inductor/Choke - 0603 and 1206. Footprints are not proven and vary greatly between part numbers.
L3 = rcl:L-US: INDUCTOR, American symbol
LED1-LED24 = 24x16_RGB:GM1WA55311A: Chip LED RGB Source: http://document.sharpsma.com/files/GM1WA55311A_SS.pdf; OC_NEWARK: unknown
MIC1 = slice_noshift:MIC: Microphone Omni-directional electret microphone. 9.7mm standard diameter.; OC_NEWARK: unknown
MODE RST = 24x16_RGB:M02: Header 2 Standard 2-pin 0.1" header. Use with straight break away headers (SKU : PRT-00116), right angle break away headers (PRT-00553), swiss pins (PRT-00743), machine pins (PRT-00117), and female headers (PRT-00115). Molex polarized connector foot print use with SKU : PRT-08233 with associated crimp pins and housings.; OC_NEWARK: unknown
R1-R3 = 24x16_RGB:RESISTOR: Resistor Basic schematic elements and footprints for 0603, 1206, and PTH 1/10th watt (small) resistors.; OC_NEWARK: unknown
R4 = slice_noshift:RESISTOR: Resistor Basic schematic elements and footprints for 0603, 1206, and PTH 1/10th watt (small) resistors.; MF: VISHAY/DALE; MPN: CRCW08051K00FKEA; OC_NEWARK: 52K9723
R5 = slice_noshift:RESISTOR: Resistor Basic schematic elements and footprints for 0603, 1206, and PTH 1/10th watt (small) resistors.; OC_NEWARK: unknown
R6 R17 = slice_noshift:RESISTOR: Resistor Basic schematic elements and footprints for 0603, 1206, and PTH 1/10th watt (small) resistors.; MPN: 08051A220KAT2A; OC_NEWARK: 96M1330
R8 = CH_passive:RESISTOR: Resistor Basic schematic elements and footprints for 0603, 1206, and PTH 1/10th watt (small) resistors.
R10 = SparkFun:RESISTOR: Resistor Basic schematic elements and footprints for 0603, 1206, and PTH 1/10th watt (small) resistors.; MPN: CRCW08054K70FKEA; OC_NEWARK: 61M5491
R11 = SparkFun:RESISTOR: Resistor Basic schematic elements and footprints for 0603, 1206, and PTH 1/10th watt (small) resistors.; MPN: CRCW08052K20FKEA; OC_NEWARK: 61M5457
R12-R15 = SparkFun:RESISTOR: Resistor Basic schematic elements and footprints for 0603, 1206, and PTH 1/10th watt (small) resistors.; OC_NEWARK: unknown
S1 S2 = SparkFun:TAC_SWITCH: Momentary Switch Button commonly used for reset or general input. Spark Fun Electronics SKU : COM-00097; OC_NEWARK: unknown
SJ1-SJ3 = SparkFun:SOLDERJUMPER: Solder Jumper Standard SMD solder jumper. Used to automate production. Two varients : Normally Open and Normally Closed are the same, but have different paste layers. NC will have a large amount of paste and should jumper during reflow.
SLOT1 SLOT2 = slice:SLOT; OC_NEWARK: unknown
TP1-TP12 = testpad:TP: Test pad; OC_NEWARK: unknown
TP13 TP14 = badge.lbrbadge_2013:SPARKFUN_TEST-POINT
TP15 TP16 = testpad:PTR1: TEST PIN
X1 = 24x16_RGB_ATXMega_Wifi:NX3225GA: NX3225GA Crystal oscillator NDK NX3225GA small surface-mount type crystal unit in compact and thin 3.2 x 2.5 x 0.75 mm package. Source: http://www.ndk.com/images/products/catalog/c_NX3225GA-STD-CRG-1_e.pdf
Z1 = USBug:PRTR5V0U2X: Ultra low capacitance double rail-to-rail ESD protection diode